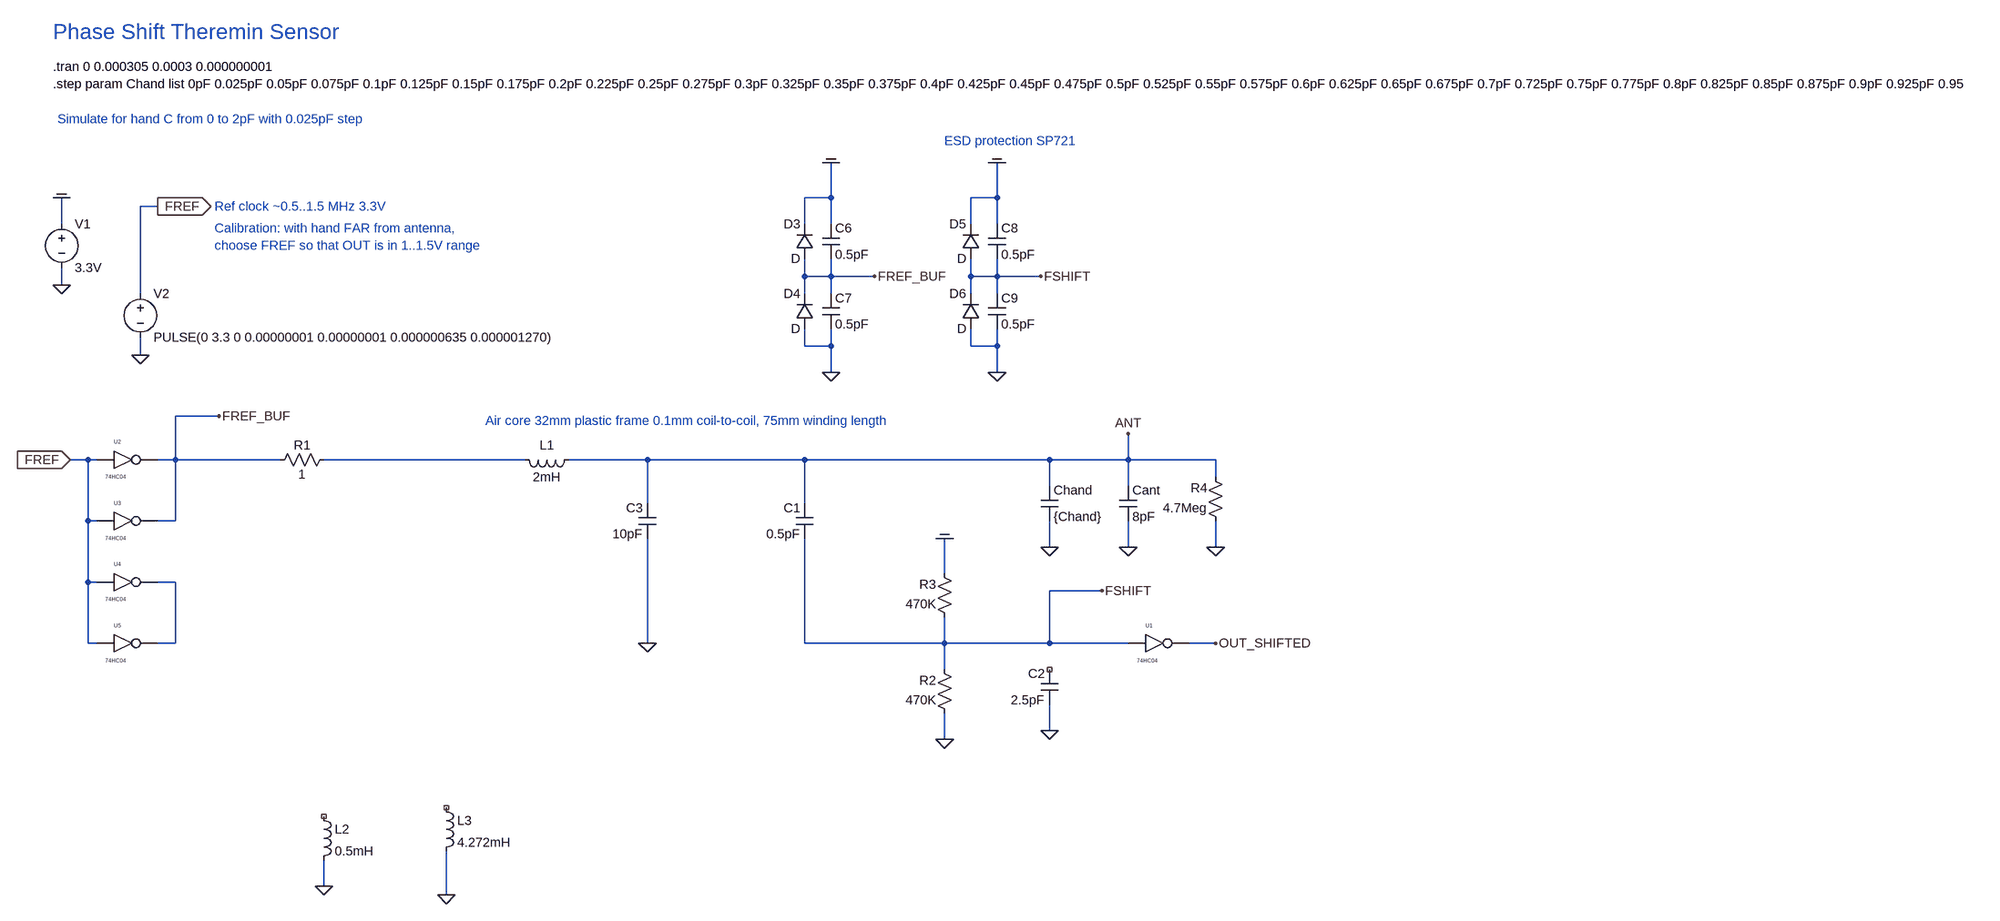
[diagram p0: schematic phase_shift_sensor_2mH_serial_lc_v5.asc]
phase_shift_sensor_2mH_serial_lc_v5.asc, the LTspice schematic file:
Version 4
SHEET 1 8128 1652
WIRE 1456 -64 1456 -128
WIRE 1456 -64 1408 -64
WIRE 1760 -64 1760 -128
WIRE 1760 -64 1712 -64
WIRE 224 -48 192 -48
WIRE 48 -16 48 -64
WIRE 1408 -16 1408 -64
WIRE 1456 -16 1456 -64
WIRE 1712 -16 1712 -64
WIRE 1760 -16 1760 -64
WIRE 1408 80 1408 48
WIRE 1456 80 1456 48
WIRE 1456 80 1408 80
WIRE 1536 80 1456 80
WIRE 1712 80 1712 48
WIRE 1760 80 1760 48
WIRE 1760 80 1712 80
WIRE 1840 80 1760 80
WIRE 48 96 48 64
WIRE 192 112 192 -48
WIRE 1408 112 1408 80
WIRE 1456 112 1456 80
WIRE 1712 112 1712 80
WIRE 1760 112 1760 80
WIRE 1408 208 1408 176
WIRE 1456 208 1456 176
WIRE 1456 208 1408 208
WIRE 1712 208 1712 176
WIRE 1760 208 1760 176
WIRE 1760 208 1712 208
WIRE 192 224 192 192
WIRE 1456 256 1456 208
WIRE 1760 256 1760 208
WIRE 336 336 256 336
WIRE 96 416 64 416
WIRE 112 416 96 416
WIRE 256 416 256 336
WIRE 256 416 224 416
WIRE 448 416 256 416
WIRE 896 416 528 416
WIRE 1120 416 976 416
WIRE 1408 416 1120 416
WIRE 1856 416 1408 416
WIRE 2000 416 2000 368
WIRE 2000 416 1856 416
WIRE 2160 416 2000 416
WIRE 2160 448 2160 416
WIRE 1856 464 1856 416
WIRE 2000 464 2000 416
WIRE 1120 496 1120 416
WIRE 1408 496 1408 416
WIRE 96 528 96 416
WIRE 112 528 96 528
WIRE 256 528 256 416
WIRE 256 528 224 528
WIRE 1856 576 1856 528
WIRE 2000 576 2000 528
WIRE 2160 576 2160 528
WIRE 1664 624 1664 560
WIRE 96 640 96 528
WIRE 112 640 96 640
WIRE 256 640 224 640
WIRE 1952 656 1856 656
WIRE 96 752 96 640
WIRE 112 752 96 752
WIRE 256 752 256 640
WIRE 256 752 224 752
WIRE 1120 752 1120 560
WIRE 1408 752 1408 560
WIRE 1664 752 1664 704
WIRE 1664 752 1408 752
WIRE 1856 752 1856 656
WIRE 1856 752 1664 752
WIRE 2000 752 1856 752
WIRE 2160 752 2112 752
WIRE 1664 800 1664 752
WIRE 1856 912 1856 864
WIRE 1664 928 1664 880
WIRE 528 1232 528 1184
WIRE 752 1248 752 1168
FLAG 48 96 0
FLAG 224 -48 FREF
IOPIN 224 -48 Out
FLAG 192 224 0
FLAG 2000 368 ANT
FLAG 2000 576 0
FLAG 1856 576 0
FLAG 48 -64 COM
FLAG 1456 256 0
FLAG 1456 -128 COM
FLAG 1760 256 0
FLAG 1760 -128 COM
FLAG 1952 656 FSHIFT
FLAG 2160 752 OUT_SHIFTED
FLAG 1840 80 FSHIFT
FLAG 64 416 FREF
IOPIN 64 416 In
FLAG 1536 80 FREF_BUF
FLAG 336 336 FREF_BUF
FLAG 1856 912 0
FLAG 1664 560 COM
FLAG 2160 576 0
FLAG 1664 928 0
FLAG 528 1232 0
FLAG 752 1248 0
FLAG 1120 752 0
SYMBOL voltage 48 -32 R0
WINDOW 123 0 0 Left 2
WINDOW 39 0 0 Left 2
SYMATTR InstName V1
SYMATTR Value 3.3V
SYMBOL voltage 192 96 R0
WINDOW 123 0 0 Left 2
WINDOW 39 0 0 Left 2
SYMATTR InstName V2
SYMATTR Value PULSE(0 3.3 0 0.00000001 0.00000001 0.000000635 0.000001270)
SYMBOL cap 1984 464 R0
SYMATTR InstName Cant
SYMATTR Value 8pF
SYMBOL cap 1840 464 R0
SYMATTR InstName Chand
SYMATTR Value {Chand}
SYMBOL diode 1424 48 R180
WINDOW 0 24 64 Left 2
WINDOW 3 24 0 Left 2
SYMATTR InstName D3
SYMBOL diode 1424 176 R180
WINDOW 0 24 64 Left 2
WINDOW 3 24 0 Left 2
SYMATTR InstName D4
SYMBOL cap 1440 -16 R0
SYMATTR InstName C6
SYMATTR Value 0.5pF
SYMBOL cap 1440 112 R0
SYMATTR InstName C7
SYMATTR Value 0.5pF
SYMBOL diode 1728 48 R180
WINDOW 0 24 64 Left 2
WINDOW 3 24 0 Left 2
SYMATTR InstName D5
SYMBOL diode 1728 176 R180
WINDOW 0 24 64 Left 2
WINDOW 3 24 0 Left 2
SYMATTR InstName D6
SYMBOL cap 1744 -16 R0
SYMATTR InstName C8
SYMATTR Value 0.5pF
SYMBOL cap 1744 112 R0
SYMATTR InstName C9
SYMATTR Value 0.5pF
SYMBOL cap 1424 560 R180
WINDOW 0 24 56 Left 2
WINDOW 3 24 8 Left 2
SYMATTR InstName C1
SYMATTR Value 0.5pF
SYMBOL EXTRA\\74HC\\74hc04 2048 688 R0
SYMATTR InstName U1
SYMATTR SpiceLine VCC=3.3  SPEED=1.0  TRIPDT=1e-9
SYMBOL EXTRA\\74HC\\74hc04 160 352 R0
SYMATTR InstName U2
SYMBOL cap 1872 864 R180
WINDOW 0 24 56 Left 2
WINDOW 3 24 8 Left 2
SYMATTR InstName C2
SYMATTR Value 2.5pF
SYMBOL res 1680 720 R180
WINDOW 0 31 76 Left 2
WINDOW 3 31 40 Left 2
SYMATTR InstName R3
SYMATTR Value 470K
SYMBOL res 1680 896 R180
WINDOW 0 31 76 Left 2
WINDOW 3 31 40 Left 2
SYMATTR InstName R2
SYMATTR Value 470K
SYMBOL res 2176 544 R180
WINDOW 0 31 76 Left 2
WINDOW 3 31 40 Left 2
SYMATTR InstName R4
SYMATTR Value 4.7Meg
SYMBOL EXTRA\\74HC\\74hc04 160 464 R0
SYMATTR InstName U3
SYMBOL ind 992 400 R90
WINDOW 0 5 56 VBottom 2
WINDOW 3 32 56 VTop 2
SYMATTR InstName L1
SYMATTR Value 2mH
SYMATTR SpiceLine Ipk=0.1 Rser=41.942 Rpar=1.861Meg Cpar=1.801pF
SYMBOL ind 512 1088 R0
SYMATTR InstName L2
SYMATTR Value 0.5mH
SYMATTR SpiceLine Ipk=0.1 Rser=19.765 Rpar=1.384Meg Cpar=1.346pF
SYMBOL ind 736 1072 R0
SYMATTR InstName L3
SYMATTR Value 4.272mH
SYMATTR SpiceLine Ipk=0.1 Rser=181.363 Rpar=0.972Meg Cpar=1.346pF
SYMBOL EXTRA\\74HC\\74hc04 160 576 R0
SYMATTR InstName U4
SYMATTR SpiceLine VCC=3.3  SPEED=1.0  TRIPDT=1e-9
SYMBOL EXTRA\\74HC\\74hc04 160 688 R0
SYMATTR InstName U5
SYMATTR SpiceLine VCC=3.3  SPEED=1.0  TRIPDT=1e-9
SYMBOL res 544 400 R90
WINDOW 0 5 56 VBottom 2
WINDOW 3 27 56 VTop 2
SYMATTR InstName R1
SYMATTR Value 1
SYMBOL cap 1136 560 R180
WINDOW 0 24 56 Left 2
WINDOW 3 24 8 Left 2
SYMATTR InstName C3
SYMATTR Value 10pF
TEXT 32 -304 Left 2 !.tran 0 0.000305 0.0003 0.000000001
TEXT 32 -272 Left 2 !.step param Chand list 0pF 0.025pF 0.05pF 0.075pF 0.1pF 0.125pF 0.15pF 0.175pF 0.2pF 0.225pF 0.25pF 0.275pF 0.3pF 0.325pF 0.35pF 0.375pF 0.4pF 0.425pF 0.45pF 0.475pF 0.5pF 0.525pF 0.55pF 0.575pF 0.6pF 0.625pF 0.65pF 0.675pF 0.7pF 0.725pF 0.75pF 0.775pF 0.8pF 0.825pF 0.85pF 0.875pF 0.9pF 0.925pF 0.95pF 0.975pF 1pF 1.025pF 1.05pF 1.075pF 1.1pF 1.125pF 1.15pF 1.175pF 1.2pF 1.225pF 1.25pF 1.275pF 1.3pF 1.325pF 1.35pF 1.375pF 1.4pF 1.425pF 1.45pF 1.475pF 1.5pF 1.525pF 1.55pF 1.575pF 1.6pF 1.625pF 1.65pF 1.675pF 1.7pF 1.725pF 1.75pF 1.775pF 1.8pF 1.825pF 1.85pF 1.875pF 1.9pF 1.925pF 1.95pF 1.975pF 2.0pF
TEXT 328 -48 Left 2 ;Ref clock ~0.5..1.5 MHz 3.3V
TEXT 32 -368 Left 4 ;Phase Shift Theremin Sensor
TEXT 824 344 Left 2 ;Air core 32mm plastic frame 0.1mm coil-to-coil, 75mm winding length
TEXT 1664 -168 Left 2 ;ESD protection SP721
TEXT 328 -8 Left 2 ;Calibration: with hand FAR from antenna,\nchoose FREF so that OUT is in 1..1.5V range
TEXT 40 -208 Left 2 ;Simulate for hand C from 0 to 2pF with 0.025pF step

The netlist it stands for:
* phase_shift_sensor_2mH_serial_lc_v5.asc
V1 COM 0 3.3V
V2 FREF 0 PULSE(0 3.3 0 0.00000001 0.00000001 0.000000635 0.000001270)
Cant ANT 0 8pF
Chand ANT 0 {Chand}
D3 FREF_BUF COM D
D4 0 FREF_BUF D
C6 COM FREF_BUF 0.5pF
C7 FREF_BUF 0 0.5pF
D5 FSHIFT COM D
D6 0 FSHIFT D
C8 COM FSHIFT 0.5pF
C9 FSHIFT 0 0.5pF
C1 FSHIFT ANT 0.5pF
XU1 FSHIFT OUT_SHIFTED VCC 0 74HC04 VCC=3.3  SPEED=1.0  TRIPDT=1e-9  ; pins A Y
XU2 FREF FREF_BUF VCC 0 74HC04 VCC=5  SPEED=1.0  TRIPDT=1e-9  ; pins A Y
C2 0 NC_01 2.5pF
R3 FSHIFT COM 470K
R2 0 FSHIFT 470K
R4 0 ANT 4.7Meg
XU3 FREF FREF_BUF VCC 0 74HC04 VCC=5  SPEED=1.0  TRIPDT=1e-9  ; pins A Y
L1 ANT N001 2mH Ipk=0.1 Rser=41.942 Rpar=1.861Meg Cpar=1.801pF
L2 NC_02 0 0.5mH Ipk=0.1 Rser=19.765 Rpar=1.384Meg Cpar=1.346pF
L3 NC_03 0 4.272mH Ipk=0.1 Rser=181.363 Rpar=0.972Meg Cpar=1.346pF
XU4 FREF N002 VCC 0 74HC04 VCC=3.3  SPEED=1.0  TRIPDT=1e-9  ; pins A Y
XU5 FREF N002 VCC 0 74HC04 VCC=3.3  SPEED=1.0  TRIPDT=1e-9  ; pins A Y
R1 N001 FREF_BUF 1
C3 0 ANT 10pF
.model D D
.lib standard.dio
.tran 0 0.000305 0.0003 0.000000001
.step param Chand list 0pF 0.025pF 0.05pF 0.075pF 0.1pF 0.125pF 0.15pF 0.175pF 0.2pF 0.225pF 0.25pF 0.275pF 0.3pF 0.325pF 0.35pF 0.375pF 0.4pF 0.425pF 0.45pF 0.475pF 0.5pF 0.525pF 0.55pF 0.575pF 0.6pF 0.625pF 0.65pF 0.675pF 0.7pF 0.725pF 0.75pF 0.775pF 0.8pF 0.825pF 0.85pF 0.875pF 0.9pF 0.925pF 0.95pF 0.975pF 1pF 1.025pF 1.05pF 1.075pF 1.1pF 1.125pF 1.15pF 1.175pF 1.2pF 1.225pF 1.25pF 1.275pF 1.3pF 1.325pF 1.35pF 1.375pF 1.4pF 1.425pF 1.45pF 1.475pF 1.5pF 1.525pF 1.55pF 1.575pF 1.6pF 1.625pF 1.65pF 1.675pF 1.7pF 1.725pF 1.75pF 1.775pF 1.8pF 1.825pF 1.85pF 1.875pF 1.9pF 1.925pF 1.95pF 1.975pF 2.0pF
* Ref clock ~0.5..1.5 MHz 3.3V
* Phase Shift Theremin Sensor
* Air core 32mm plastic frame 0.1mm coil-to-coil, 75mm winding length
* ESD protection SP721
* Calibration: with hand FAR from antenna,
* choose FREF so that OUT is in 1..1.5V range
* Simulate for hand C from 0 to 2pF with 0.025pF step
.lib 74HC.lib
.backanno
.end